# EAGLE design AtariPunkConsole (EAGLE 6.4)
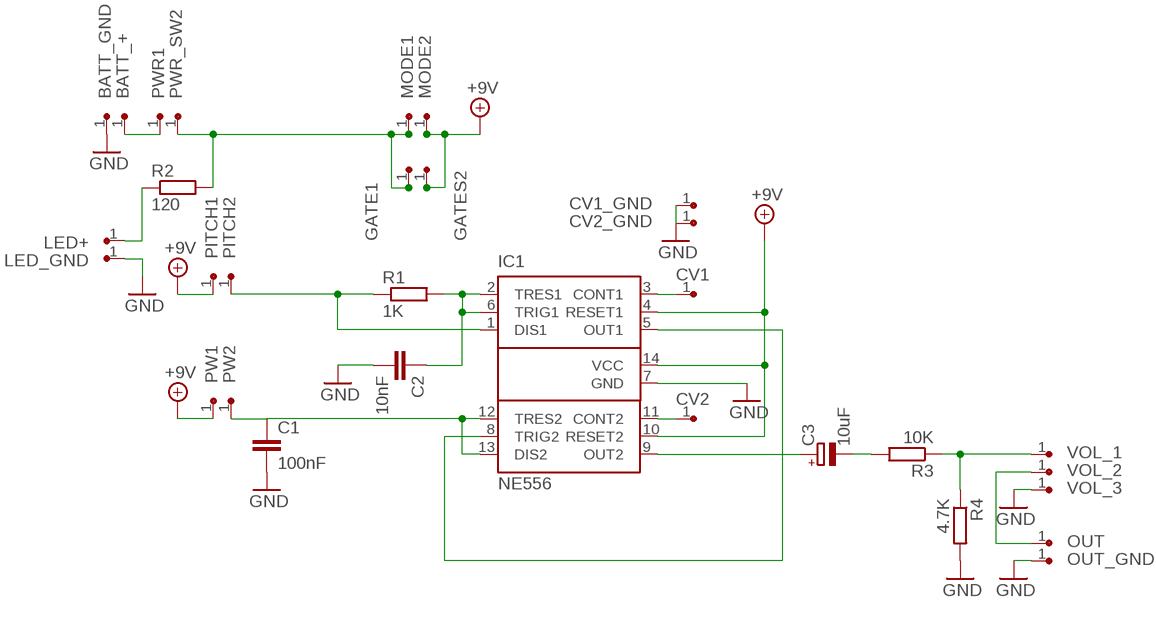
[diagram p0: schematic, sheet 1]

## Parts
BATT_+  CV1  SINGLE_PAD  [SINGLE_PAD]
BATT_GND  CV1  SINGLE_PAD  [SINGLE_PAD]
C1  100nF  C-EU050-025X075  [C050-025X075]
C2  10nF  C-EU050-025X075  [C050-025X075]
C3  10uF  CPOL-EUE5-5  [E5-5]
CV1  CV1  SINGLE_PAD  [SINGLE_PAD]
CV1_GND  CV1  SINGLE_PAD  [SINGLE_PAD]
CV2  CV1  SINGLE_PAD  [SINGLE_PAD]
CV2_GND  CV1  SINGLE_PAD  [SINGLE_PAD]
GATE1  CV1  SINGLE_PAD  [SINGLE_PAD]
GATES2  CV1  SINGLE_PAD  [SINGLE_PAD]
IC1  NE556  [DIL14]
LED+  CV1  SINGLE_PAD  [SINGLE_PAD]
LED_GND  CV1  SINGLE_PAD  [SINGLE_PAD]
MODE1  CV1  SINGLE_PAD  [SINGLE_PAD]
MODE2  CV1  SINGLE_PAD  [SINGLE_PAD]
OUT  CV1  SINGLE_PAD  [SINGLE_PAD]
OUT_GND  CV1  SINGLE_PAD  [SINGLE_PAD]
PITCH1  CV1  SINGLE_PAD  [SINGLE_PAD]
PITCH2  CV1  SINGLE_PAD  [SINGLE_PAD]
PW1  CV1  SINGLE_PAD  [SINGLE_PAD]
PW2  CV1  SINGLE_PAD  [SINGLE_PAD]
PWR1  CV1  SINGLE_PAD  [SINGLE_PAD]
PWR_SW2  CV1  SINGLE_PAD  [SINGLE_PAD]
R1  1K  R-EU_0204/7  [0204/7]
R2  120  R-EU_0204/7  [0204/7]
R3  10K  R-EU_0204/7  [0204/7]
R4  4.7K  R-EU_0204/7  [0204/7]
VOL_1  CV1  SINGLE_PAD  [SINGLE_PAD]
VOL_2  CV1  SINGLE_PAD  [SINGLE_PAD]
VOL_3  CV1  SINGLE_PAD  [SINGLE_PAD]

## Nets
+9V: GATES2.1 IC1.4(RESET1) IC1.10(RESET2) IC1.14(VCC) MODE2.1 PITCH1.1 PW1.1
GND: BATT_GND.1 C1.2 C2.2 CV1_GND.1 CV2_GND.1 IC1.7(GND) LED_GND.1 OUT_GND.1 R4.2 VOL_3.1
N$1: C2.1 IC1.2(TRES1) IC1.6(TRIG1) R1.2
N$2: IC1.1(DIS1) PITCH2.1 R1.1
N$3: CV2.1 IC1.11(CONT2)
N$4: IC1.5(OUT1) IC1.8(TRIG2)
N$5: C3.+ IC1.9(OUT2)
N$6: CV1.1 IC1.3(CONT1)
N$7: OUT.1 VOL_2.1
N$8: C1.1 IC1.12(TRES2) IC1.13(DIS2) PW2.1
N$9: R3.1 R4.1 VOL_1.1
N$10: BATT_+.1 PWR1.1
N$12: LED+.1 R2.1
N$13: C3.- R3.2
PWR2: GATE1.1 MODE1.1 PWR_SW2.1 R2.2

## Library data of the parts
BATT_+ BATT_GND CV1 CV1_GND CV2 CV2_GND GATE1 GATES2 LED+ LED_GND MODE1 MODE2 OUT OUT_GND PITCH1 PITCH2 PW1 PW2 PWR1 PWR_SW2 VOL_1-VOL_3 = joakim:SINGLE_PAD: Single pad/connector
C1 C2 = joa-hand_etching:C-EU: CAPACITOR, European symbol
C3 = joa-hand_etching:CPOL-EU: POLARIZED CAPACITOR, European symbol
IC1 = st-microelectronics:NE556: General Purpose Biopolartimer; MPN: NE556; OC_FARNELL: 2349784; OC_NEWARK: 83C0108
R1-R4 = joa-hand_etching:R-EU_: RESISTOR, European symbol

## Board
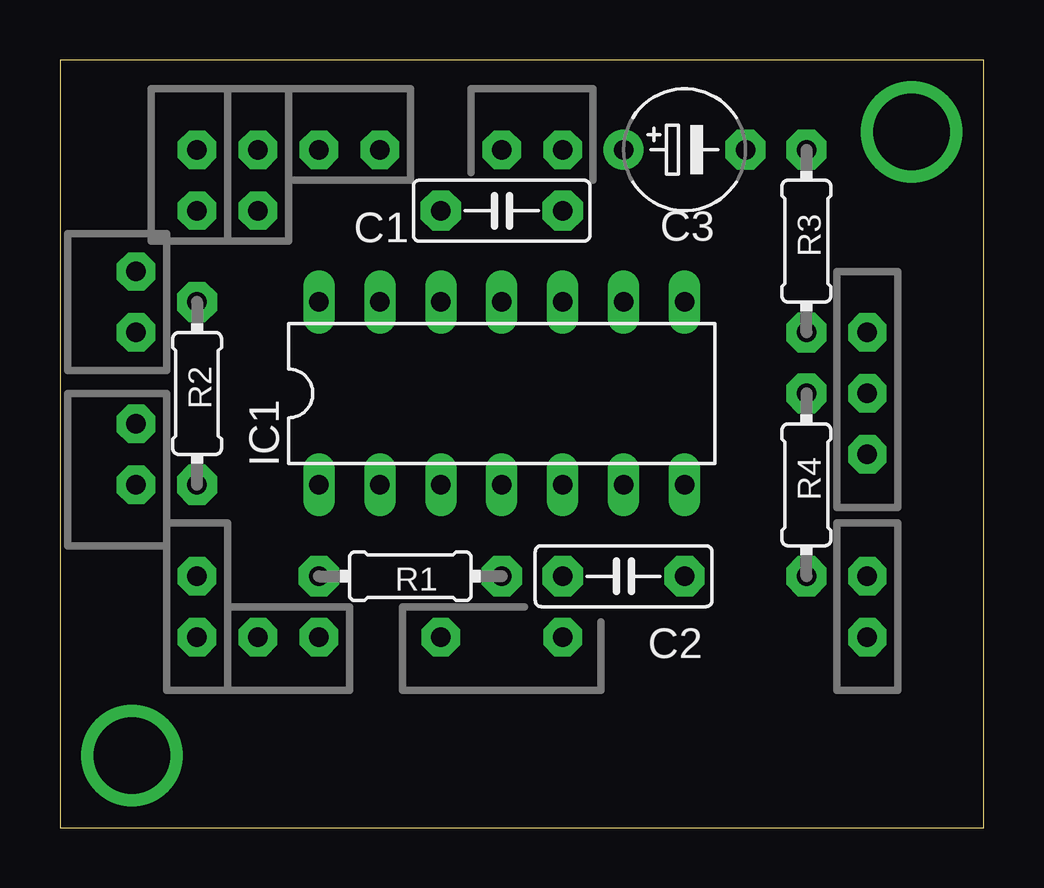
[diagram p1: board, top side]
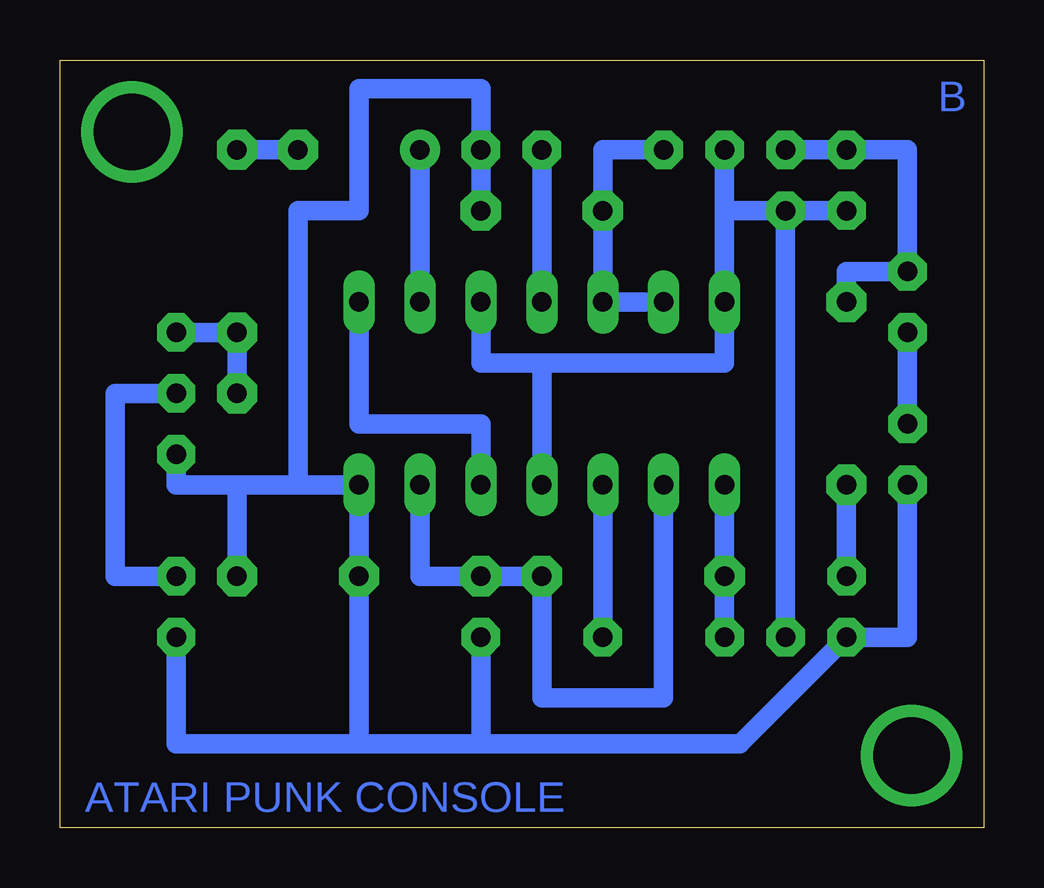
[diagram p2: board, bottom side, seen from below]

Size 38.5 x 32 mm. Coordinates in mm from the lower left corner, seen from the top.
Outline: 0,0 38.5,0 38.5,32 0,32 0,0
Copper layers (1*16): Top 0.035mm / dielectric 1.5mm / Bottom 0.035mm
Design rules "default": minimum track width 10mil, minimum drill 24mil, track to track 8mil, track to pad 8mil, pad to pad 8mil, via to via 8mil, smd to smd 8mil, copper to edge 40mil, drill to drill 8mil, minimum pad ring 10mil, minimum via ring 8mil, stop-mask expansion 4mil, vias tented up to drill 0mil, thermal gap 10mil

### Footprints (pad centres in the part's own frame; a part is rotated, then mirrored left to right if it is on the bottom)
SINGLE_PAD = drill 0.813 pad 1.6 octagon: 1 0,0
C050-025X075 = drill 0.813 pad 1.676 octagon: 1 -2.54,0; 2 2.54,0
E5-5 = drill 0.813 pad 1.676: + -2.54,0 | drill 0.813 pad 1.676 octagon: - 2.54,0
DIL14 = drill 0.813 long: 1 -7.62,-3.81; 2 -5.08,-3.81; 3 -2.54,-3.81; 4 0,-3.81; 5 2.54,-3.81; 6 5.08,-3.81; 7 7.62,-3.81; 8 7.62,3.81; 9 5.08,3.81; 10 2.54,3.81; 11 0,3.81; 12 -2.54,3.81; 13 -5.08,3.81; 14 -7.62,3.81
0204/7 = drill 0.813 pad 1.676 octagon: 1 -3.81,0; 2 3.81,0

### Placement (x,y rotation side)
BATT_+  3.17,16.83 180 top
BATT_GND  3.17,14.29 180 top
C1  18.41,25.72 0 top
C2  23.5,10.48 0 top
C3  26.04,28.26 0 top
CV1  15.88,7.94 270 top
CV1_GND  20.95,7.94 270 top
CV2  18.41,28.26 90 top
CV2_GND  20.95,28.26 90 top
GATE1  8.26,28.26 90 top
GATES2  8.26,25.72 90 top
IC1  18.41,18.1 0 top
LED+  5.71,10.48 0 top
LED_GND  5.71,7.94 270 top
MODE1  5.71,28.26 90 top
MODE2  5.71,25.72 90 top
OUT  33.66,10.48 0 top
OUT_GND  33.66,7.94 0 top
PITCH1  8.26,7.94 90 top
PITCH2  10.79,7.94 270 top
PW1  10.79,28.26 90 top
PW2  13.34,28.26 90 top
PWR1  3.17,20.64 90 top
PWR_SW2  3.17,23.18 90 top
R1  14.61,10.48 0 top
R2  5.71,18.1 90 top
R3  31.11,24.45 90 top
R4  31.11,14.29 270 top
VOL_1  33.66,20.64 0 top
VOL_2  33.66,18.1 0 top
VOL_3  33.66,15.56 0 top

### Tracks (layer width: path | path; a pad name or v marks a point on that pad's centre or on a via)
+9V
  Bottom 0.813: IC1.10 20.95,19.37 18.41,19.37 | 18.41,19.37 10.79,19.37 IC1.14 10.79,25.72 | IC1.4 18.41,19.37 | GATES2.1 10.79,25.72 | 10.79,25.72 PW1.1 | PITCH1.1 GATES2.1 | GATES2.1 MODE2.1
GND
  Bottom 0.813: 28.57,14.29 28.57,25.72 26.04,25.72 26.04,30.8 20.95,30.8 CV2_GND.1 C1.2 | 28.57,14.29 IC1.7 C2.2 26.04,3.49 | BATT_GND.1 3.17,7.94 LED_GND.1 10.16,3.49 20.95,3.49 | 28.57,14.29 31.11,14.29 | 31.11,14.29 33.66,14.29 VOL_3.1 | 26.04,3.49 33.66,3.49 OUT_GND.1 | R4.2 31.11,14.29 | 20.95,3.49 CV1_GND.1 | 26.04,3.49 20.95,3.49
N$1
  Bottom 0.813: IC1.6 23.5,10.48 C2.1 R1.2 18.41,5.4 13.34,5.4 IC1.2
N$2
  Bottom 0.813: IC1.1 R1.1 PITCH2.1
N$3
  Bottom 0.813: CV2.1 IC1.11
N$4
  Bottom 0.813: IC1.5 20.95,16.83 26.04,16.83 IC1.8
N$5
  Bottom 0.813: C3.+ IC1.9
N$6
  Bottom 0.813: IC1.3 CV1.1
N$7
  Bottom 0.813: VOL_2.1 36.2,18.1 36.2,10.48 OUT.1
N$8
  Bottom 0.813: IC1.13 IC1.12 C1.1 15.88,28.26 PW2.1
N$9
  Bottom 0.813: R4.1 R3.1 VOL_1.1
N$10
  Bottom 0.813: BATT_+.1 PWR1.1
N$11  (via drill 1)
  other vias: 3,3
N$12
  Bottom 0.813: LED+.1 R2.1
N$13
  Bottom 0.813: C3.- R3.2
N$14  (via drill 3.2)
  other vias: 35.5,29 3,3
N$15  (via drill 1)
  other vias: 35.5,29
PWR2
  Bottom 0.813: GATE1.1 MODE1.1 3.17,28.26 PWR_SW2.1 5.71,23.18 R2.2

### Text on the board
Bottom: B | ATARI PUNK CONSOLE
tDocu: Mode | Gate | Pw pot | CV2 | Gnd | Vol | Power switch | + | - | Gnd | Battery | + | Out | LED | Pitch pot | CV1 | Gnd | Gnd